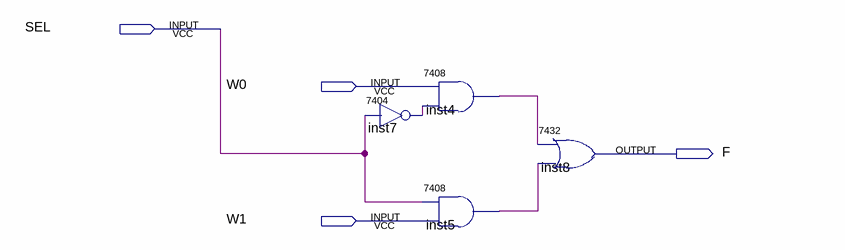
[diagram p0: schematic sheet]
// Quartus schematic 2x1MuxTypeF.bdf as structural Verilog: 4 symbols, 4 pins
module \2x1MuxTypeF  (
  input  SEL,
  input  W0,
  input  W1,
  output F
);

  wire inst4_1, inst5_1, inst7_1;

  \7404  inst7 (.\2 (SEL), .\1 (inst7_1));
  \7408  inst4 (.\3 (inst7_1), .\2 (W0), .\1 (inst4_1));
  \7408  inst5 (.\3 (W1), .\2 (SEL), .\1 (inst5_1));
  \7432  inst8 (.\2 (inst4_1), .\3 (inst5_1), .\1 (F));
endmodule
